# EAGLE schematic ESP32WROVER (EAGLE 9.7.0)
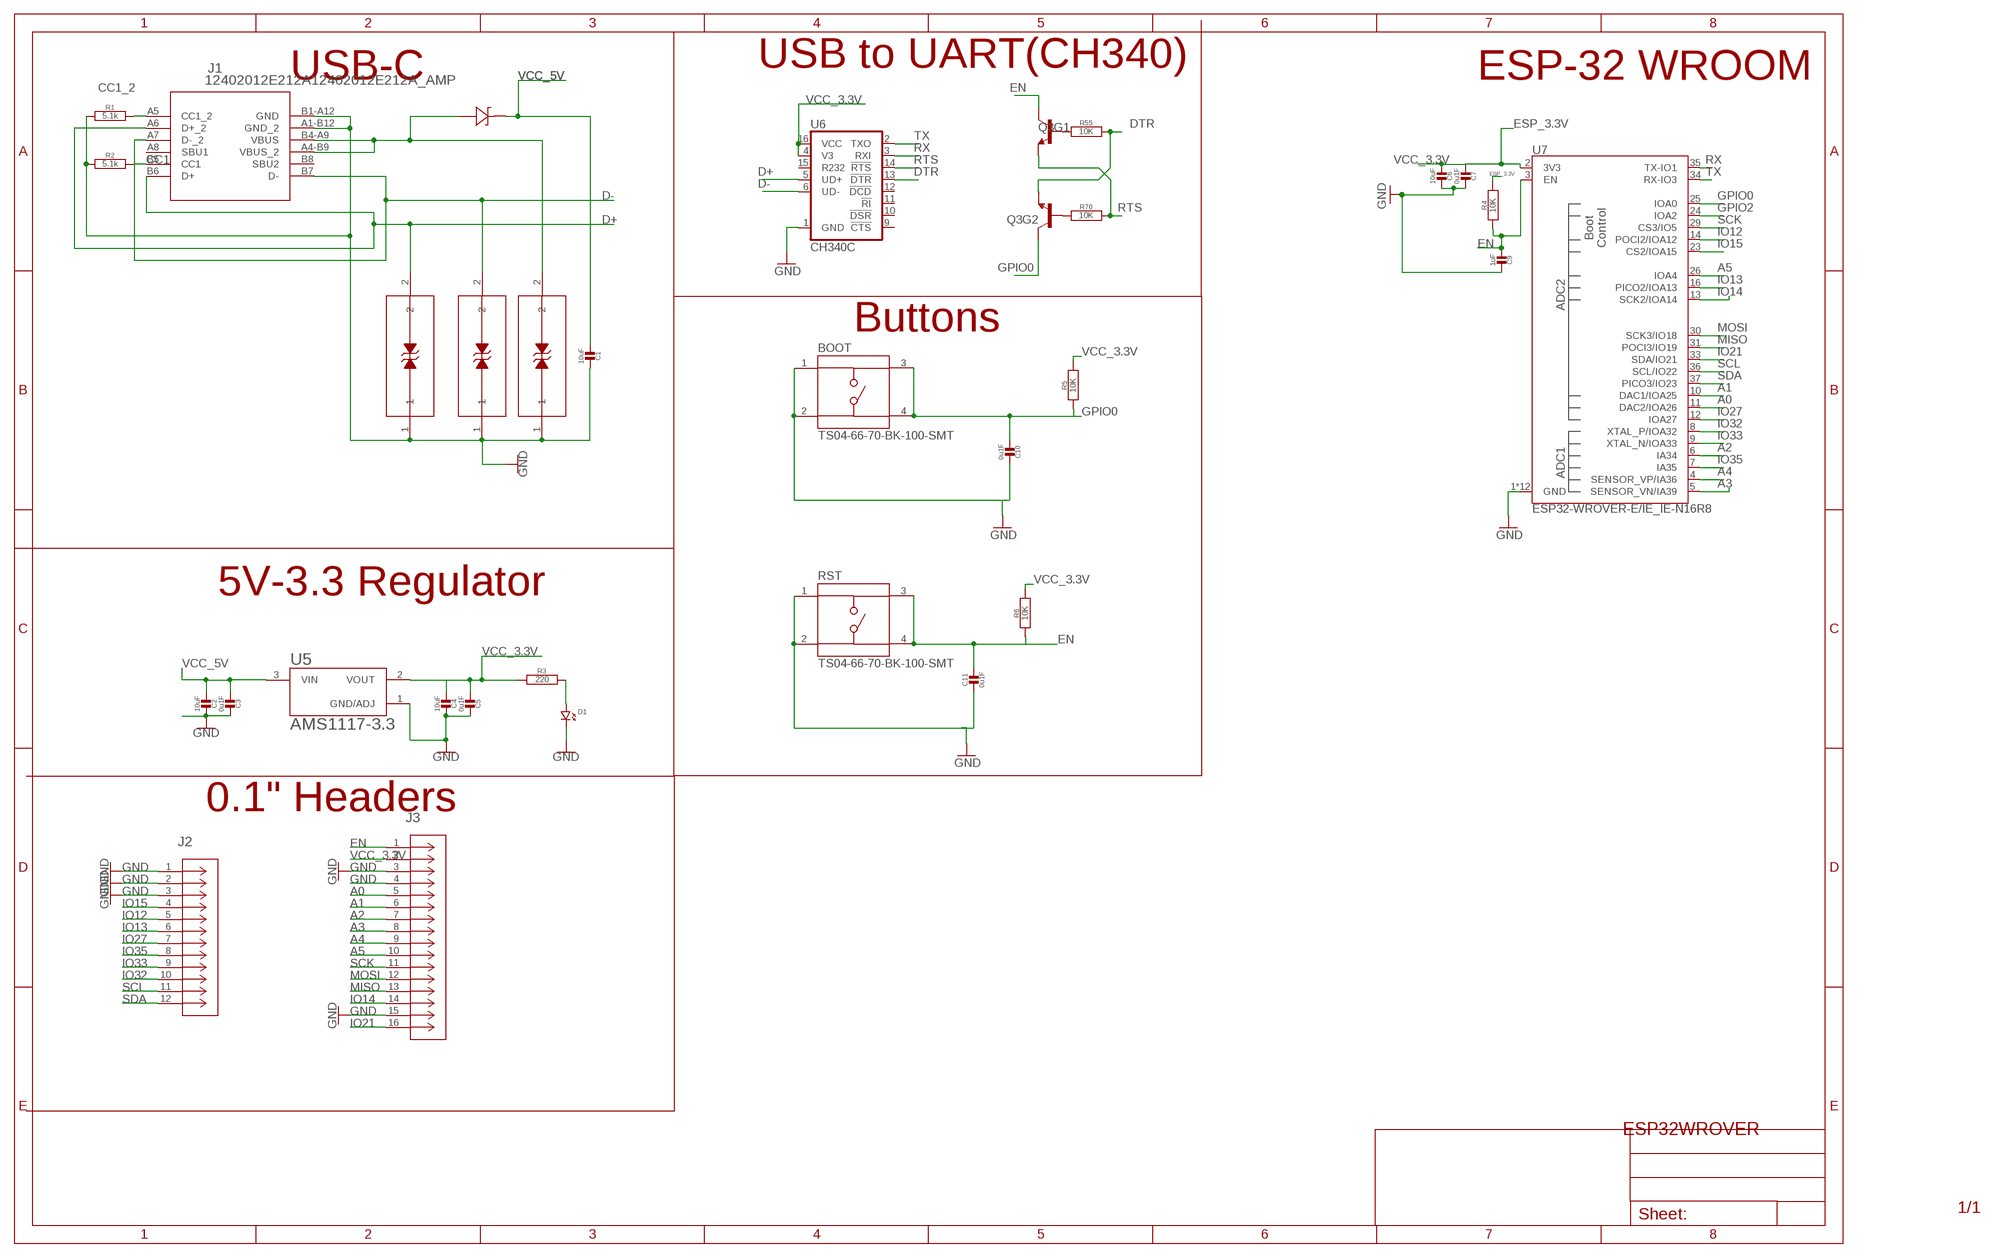
[diagram p0: schematic, sheet 1]

## Parts
BOOT  TS04-66-70-BK-100-SMT  [SW_TS04-66-70-BK-100-SMT]
C1  10uF  CAPACITOR.0603  [0603]
C2  10uF  CAPACITOR.0603  [0603]
C3  0u1F  CAPACITOR.0603  [0603]
C4  10uF  CAPACITOR.0603  [0603]
C5  0u1F  CAPACITOR.0603  [0603]
C6  10uF  CAPACITOR.0603  [0603]
C7  0u1F  CAPACITOR.0603  [0603]
C9  1uF  CAPACITOR.0603  [0603]
C10  0u1F  CAPACITOR.0603  [0603]
C11  0u1F  CAPACITOR.0603  [0603]
CR1  PESD36VS1UJXSC-90_SOD323F_NEX  [SC-90_SOD323F_NEX]
D1  LED.0402  [0402.LED]
J1  12402012E212A12402012E212A_AMP  [12402012E212A_AMP]
J2  61301211121CONN12_1211121_WRE  [CONN12_1211121_WRE]
J3  22032161CONN-4030-CTK16_MOL  [CONN-4030-CTK16_MOL]
Q3  TRANS_NPN_DUAL-MBT3904DW1T1  [SC70-6]
R1  5.1k  RESISTOR.0402  [0402]
R2  5.1k  RESISTOR.0402  [0402]
R3  220  RESISTOR.0402  [0402]
R4  10K  RESISTOR.0603  [0603]
R5  10K  RESISTOR.0603  [0603]
R6  10K  RESISTOR.0603  [0603]
R55  10K  RESISTOR.0603  [0603]
R70  10K  RESISTOR.0603  [0603]
RST  TS04-66-70-BK-100-SMT  [SW_TS04-66-70-BK-100-SMT]
U2  ESD9B5.0ST5GSOD-923_ONS-L  [SOD-923_ONS-L]
U3  ESD9B5.0ST5GSOD-923_ONS-L  [SOD-923_ONS-L]
U4  ESD9B5.0ST5GSOD-923_ONS-L  [SOD-923_ONS-L]
U5  AMS1117-3.3  [SOT229P700X180-4N]
U6  CH340C  [SO016]
U7  ESP32-WROVER-E/IE_IE-N16R8  [ESP32-WROVER-E/IE]

## Nets
A0: J3.5 U7.11(DAC2/IOA26)
A1: J3.6 U7.10(DAC1/IOA25)
A2: J3.7 U7.6(IA34)
A3: J3.8 U7.5(SENSOR_VN/IA39)
A4: J3.9 U7.4(SENSOR_VP/IA36)
A5: J3.10 U7.26(IOA4)
CC1: J1.B5(CC1) R2.2
CC1_2: J1.A5(CC1_2) R1.2
D+: J1.A6(D+_2) J1.B6(D+) U2.2 U6.5(UD+)
D-: J1.A7(D-_2) J1.B7(D-) U3.2 U6.6(UD-)
DTR: Q3.1(E) R55.2 U6.13(!DTR)
EN: C9.1 C11.1 J3.1 Q3.3(C) R4.1 R6.1 RST.3 RST.4 U7.3(EN)
ESP_3.3V: C7.1 R4.2 U7.2(3V3)
GND: BOOT.1 BOOT.2 C1.2 C2.2 C3.2 C4.2 C5.2 C6.2 C7.2 C9.2 C10.2 D1.P$2 J1.A1-B12(GND_2) J1.B1-A12(GND) J2.1 J2.2 J2.3 J3.3 J3.4 J3.15 R1.1 R2.1 U2.1 U3.1 U4.1 U5.1(GND/ADJ) U6.1(GND) U7.1(GND) U7.15(GND) U7.38(GND) U7.GND U7.GNDT1(GND) U7.GNDT2(GND) U7.GNDT3(GND) U7.GNDT4(GND) U7.GNDT5(GND) U7.GNDT6(GND) U7.GNDT7(GND) U7.GNDT8(GND)
GND1: C11.2 RST.1 RST.2
GPIO0: BOOT.3 BOOT.4 C10.1 Q3.6(C) R5.1 U7.25(IOA0)
GPIO2: U7.24(IOA2)
IO12: J2.5 U7.14(POCI2/IOA12)
IO13: J2.6 U7.16(PICO2/IOA13)
IO14: J3.14 U7.13(SCK2/IOA14)
IO15: J2.4 U7.23(CS2/IOA15)
IO21: J3.16 U7.33(SDA/IO21)
IO27: J2.7 U7.12(IOA27)
IO32: J2.10 U7.8(XTAL_P/IOA32)
IO33: J2.9 U7.9(XTAL_N/IOA33)
IO35: J2.8 U7.7(IA35)
MISO: J3.13 U7.31(POCI3/IO19)
MOSI: J3.12 U7.30(SCK3/IO18)
N$1: D1.P$1 R3.2
N$5: Q3.5(B) R55.1
N$11: Q3.2(B) R70.1
RTS: Q3.4(E) R70.2 U6.14(!RTS)
RX: U6.3(RXI) U7.35(TX-IO1)
SCK: J3.11 U7.29(CS3/IO5)
SCL: J2.11 U7.36(SCL/IO22)
SDA: J2.12 U7.37(PICO3/IO23)
TX: U6.2(TXO) U7.34(RX-IO3)
VCC_3.3V: C4.1 C5.1 C6.1 J3.2 R3.1 R5.2 R6.2 U5.2(VOUT) U6.4(V3) U6.16(VCC)
VCC_5V: C1.1 C2.1 C3.1 CR1.1 CR1.2 J1.A4-B9(VBUS_2) J1.B4-A9(VBUS) U4.2 U5.3(VIN)
Unconnected: J1.A8(SBU1) J1.B8(SBU2) U6.9(!CTS) U6.10(!DSR) U6.11(!RI) U6.12(!DCD) U6.15(R232)

## Notes on the sheet
- USB-C | USB to UART(CH340) | ESP-32 WROOM
- Buttons
- 5V-3.3 Regulator
- 0.1" Headers

## Library data of the parts
BOOT RST = TS04-66-70-BK-100-SMT:TS04-66-70-BK-100-SMT; MANUFACTURER: CUI Devices; PARTREV: 1.0; STANDARD: Manufacturer Recommendations
C1-C7 C9-C11 = CL-StandardParts:CAPACITOR
CR1 = 2024-05-29_18-45-12_Library:PESD36VS1UJX; COPYRIGHT: Copyright (C) 2024 Ultra Librarian. All rights reserved.; MANUFACTURER_PART_NUMBER: PESD36VS1UJX; MFR_NAME: Nexperia
D1 = CL-StandardParts:LED
J1 = 2025-04-15_23-17-25_Library:12402012E212A; COPYRIGHT: Copyright (C) 2025 Ultra Librarian. All rights reserved.; MANUFACTURER_PART_NUMBER: 12402012E212A; MFR_NAME: Amphenol ICC
J2 = off12pin:61301211121; COPYRIGHT: Copyright (C) 2024 Ultra Librarian. All rights reserved.; MANUFACTURER_PART_NUMBER: 61301211121; MFR_NAME: Wurth Electronics; TYPE: Headers, Male Pins
J3 = off16:22032161; COPYRIGHT: Copyright (C) 2024 Ultra Librarian. All rights reserved.; MANUFACTURER_PART_NUMBER: 22032161; MFR_NAME: Molex Connector Corporation
Q3 = SparkFun-DiscreteSemi:TRANS_NPN_DUAL: Dual NPN Transistors in Single Package The MBT3904W1 puts two general purpose 3904 NPN transistors in a single package. Datasheet <http://www.onsemi.com/pub_link/Collateral/MBT3904DW1T1-D.PDF> SparkFun Products: SparkFun ESP32 Thing <https://www.sparkfun.com/products/13907>; PROD_ID: TRANS-13337
R1 R2 R4-R6 R55 R70 = CL-StandardParts:RESISTOR
R3 = CL-StandardParts:RESISTOR; SPICEPREFIX: R
U2-U4 = protection diode :ESD9B5.0ST5G; COPYRIGHT: Copyright (C) 2024 Ultra Librarian. All rights reserved.; MANUFACTURER_PART_NUMBER: ESD9B5.0ST5G; MFR_NAME: onsemi
U5 = AMS1117-3.3:AMS1117-3.3: Check availability <https://pricing.snapeda.com/parts/AMS1117-3.3/Advanced%20Monolithic%20Systems/view-part?ref=eda>; AVAILABILITY: Not in stock; CHECK_PRICES: https://www.snapeda.com/parts/AMS1117-3.3/Advanced+Monolithic+Systems/view-part/?ref=eda; DESCRIPTION: Sot223/Pkg 1-Amp 3.3-Volt Low Drop Out Voltage Regulatator; MF: Advanced Monolithic Systems; MP: AMS1117-3.3; PACKAGE: SOT-223 Seeed Technology; PRICE: None; SNAPEDA_LINK: https://www.snapeda.com/parts/AMS1117-3.3/Advanced+Monolithic+Systems/view-part/?ref=snap
U6 = SparkFun-IC-Comms:CH340C; PROD_ID: IC-14038
U7 = SparkFun-RF:ESP32-WROVER-E/IE: ESP32-WROVER-E/IE ESP32-WROVER-E uses the onboard antenna. ESP32-WROVER-IE has a u.FL antenna connector, but is otherwise the same as the -E. N16R8 has 16M Flash, 8M PSRAM; PROD_ID: IC-19265

## Net classes
3 GND: width 0.254 mm